# EAGLE design sensorBoardSchematic2 (EAGLE 7.5.0)
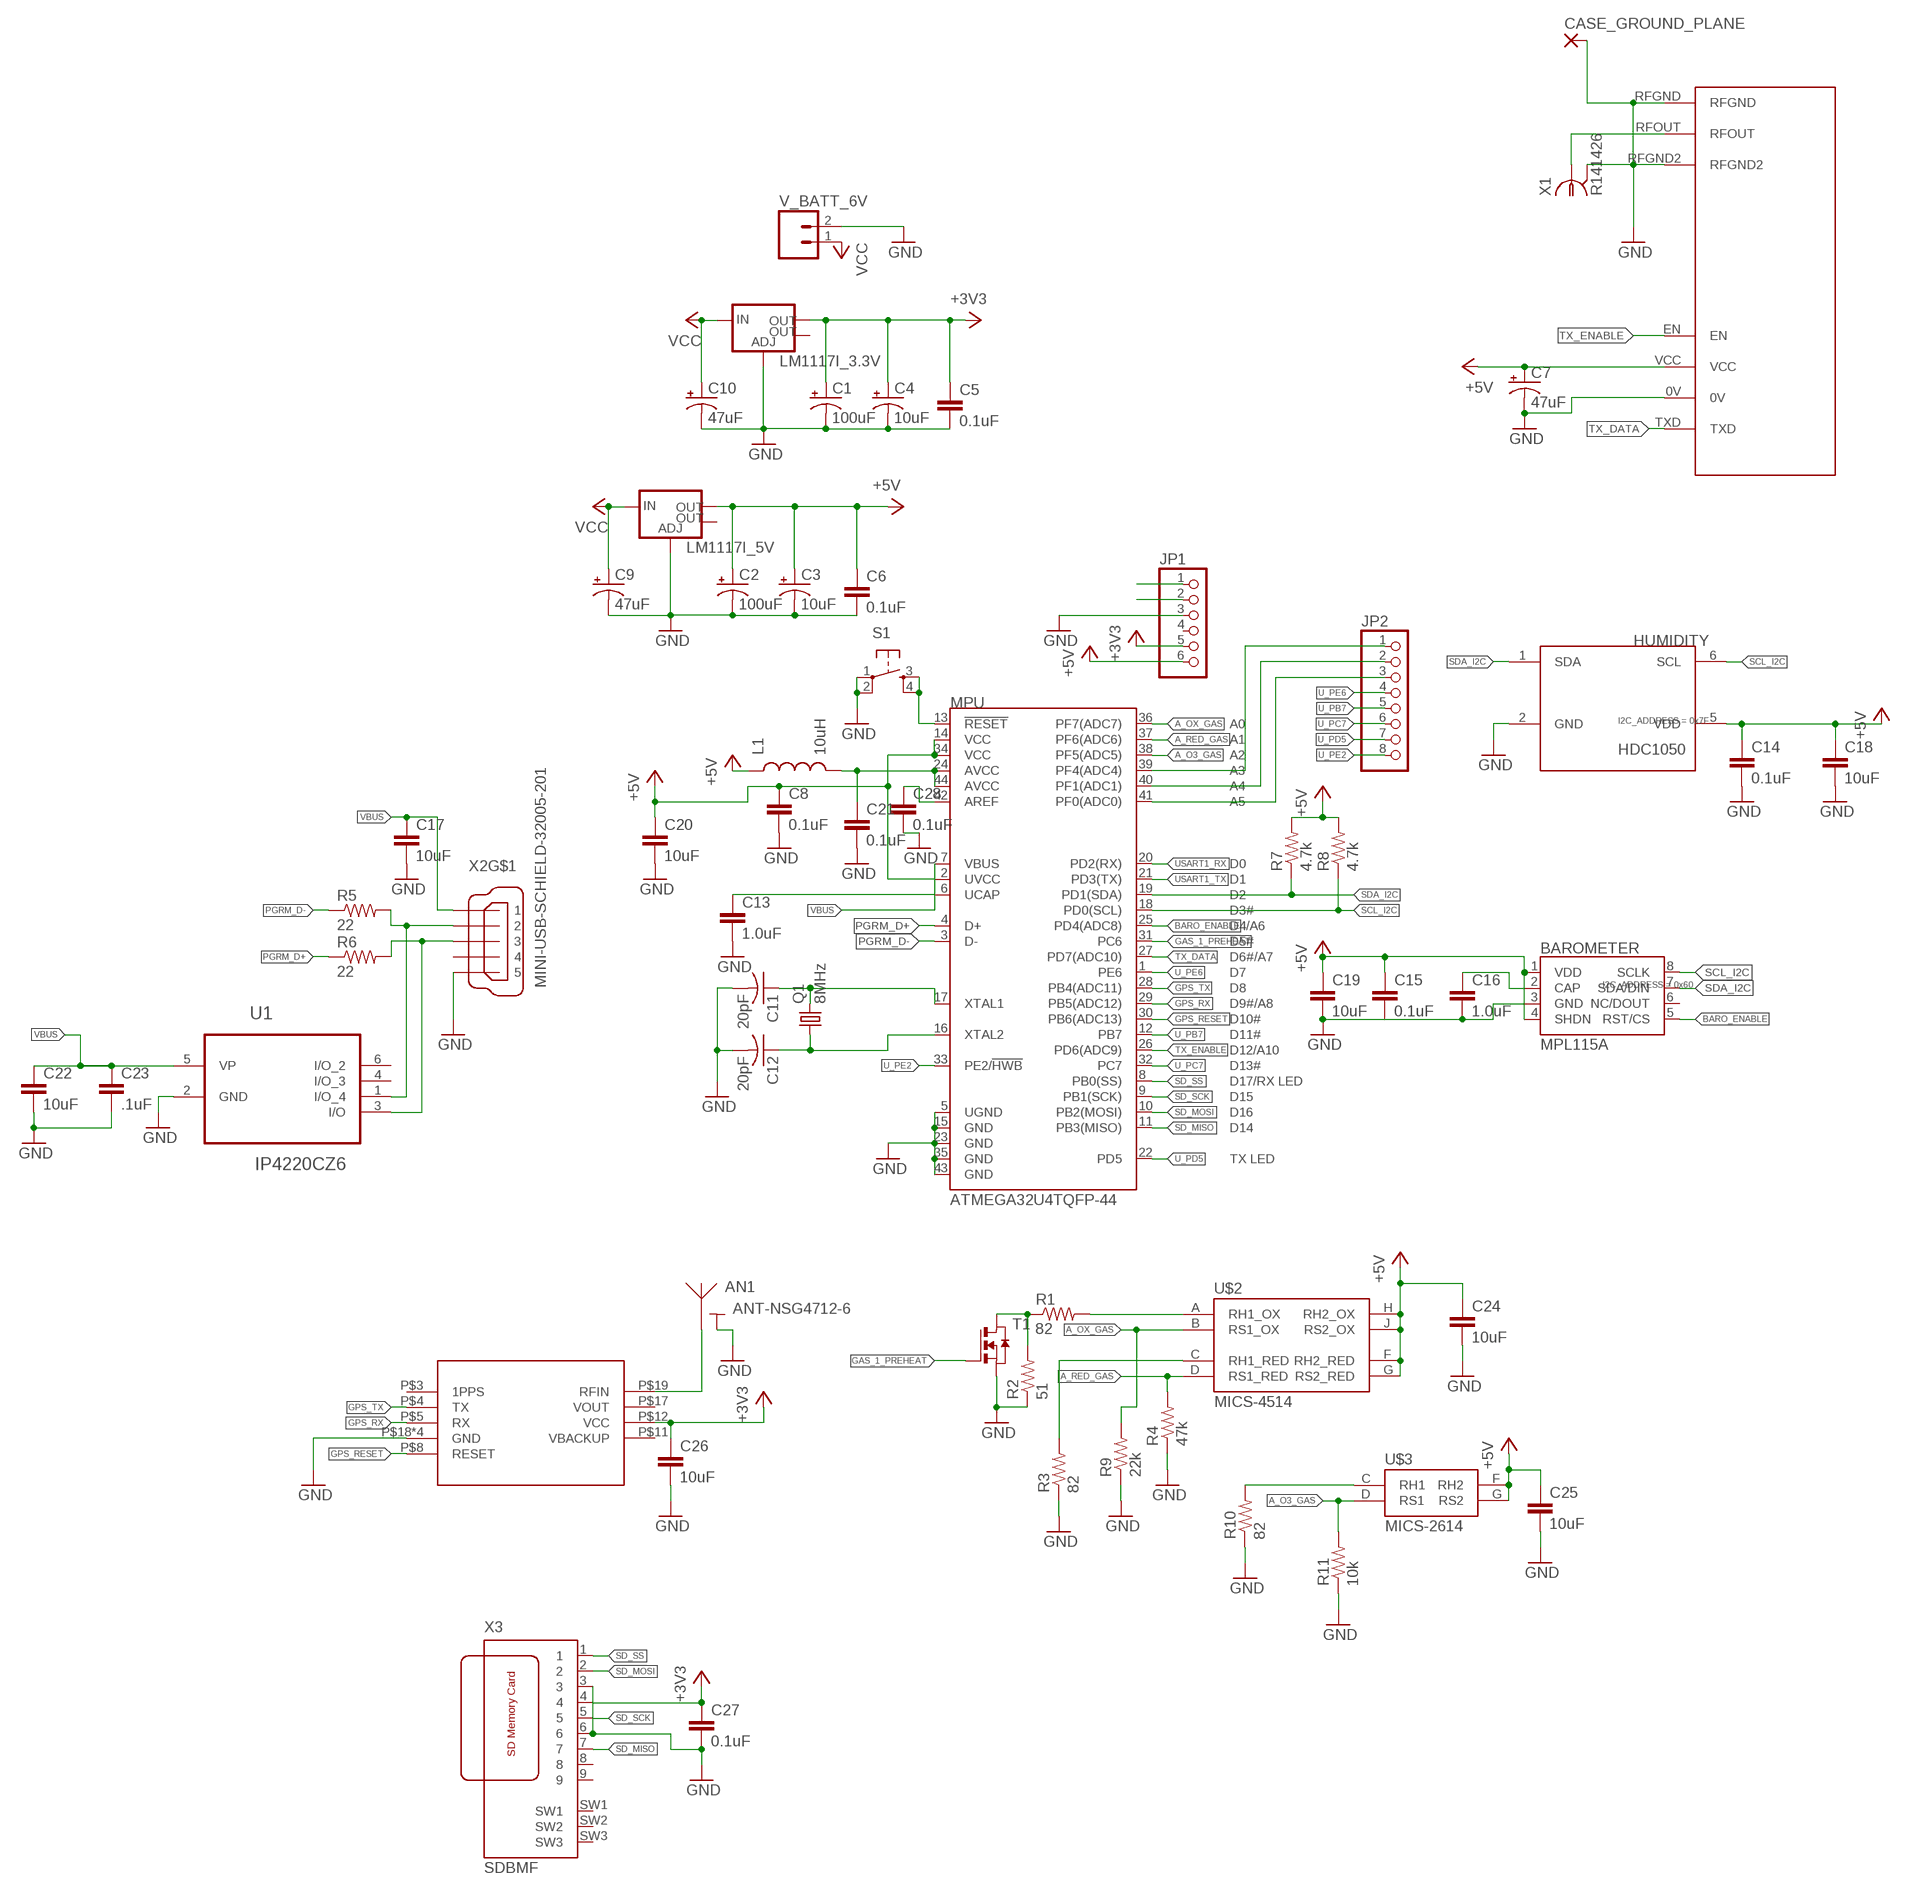
[diagram p0: schematic, sheet 1]

## Parts
AN1  ANT-NSG4712-6  [ANT-NSG4712-6]
BAROMETER  MPL115A  [LGA8]
C1  100uF  100UF-10V-10%(TANT)  [EIA7343]
C2  100uF  100UF-10V-10%(TANT)  [EIA7343]
C3  10uF  10UF-TANT  [EIA3216]
C4  10uF  10UF-TANT  [EIA3216]
C5  0.1uF  .1UF-CERCAP-08604  [0402-CAP]
C6  0.1uF  .1UF-CERCAP-08604  [0402-CAP]
C7  47uF  47UF-10V-10%(TANT)  [EIA3528]
C8  0.1uF  1.0UF-16V-10%(0603)  [0603-CAP]
C9  47uF  47UF-10V-10%(TANT)  [EIA3528]
C10  47uF  47UF-10V-10%(TANT)  [EIA3528]
C11  20pF  C-USC0402  [C0402]
C12  20pF  C-USC0402  [C0402]
C13  1.0uF  1.0UF-16V-10%(0603)  [0603-CAP]
C14  0.1uF  1.0UF-16V-10%(0603)  [0603-CAP]
C15  0.1uF  1.0UF-16V-10%(0603)  [0603-CAP]
C16  1.0uF  1.0UF-16V-10%(0603)  [0603-CAP]
C17  10uF  1.0UF-16V-10%(0603)  [0603-CAP]
C18  10uF  1.0UF-16V-10%(0603)  [0603-CAP]
C19  10uF  1.0UF-16V-10%(0603)  [0603-CAP]
C20  10uF  1.0UF-16V-10%(0603)  [0603-CAP]
C21  0.1uF  1.0UF-16V-10%(0603)  [0603-CAP]
C22  10uF  1.0UF-16V-10%(0603)  [0603-CAP]
C23  .1uF  1.0UF-16V-10%(0603)  [0603-CAP]
C24  10uF  1.0UF-16V-10%(0603)  [0603-CAP]
C25  10uF  1.0UF-16V-10%(0603)  [0603-CAP]
C26  10uF  1.0UF-16V-10%(0603)  [0603-CAP]
C27  0.1uF  .1UF-CERCAP-08604  [0402-CAP]
C28  0.1uF  1.0UF-16V-10%(0603)  [0603-CAP]
CASE_GROUND_PLANE  3,81/1,4  [3,81/1,4]
HUMIDITY  HDC1050  [TI-S-PWSON-N6]
IC1  RXM-GPS-FM  [SMD-22]
JP1  PINHD-1X6  [1X06]
JP2  PINHD-1X8  [1X08]
L1  10uH  INDUCTOR1007  [1007]
LM1117I_3.3V  V_REG_LM1117SOT223  [SOT223]
LM1117I_5V  V_REG_LM1117SOT223  [SOT223]
MPU  ATMEGA32U4TQFP-44  [TQFP44]
Q1  8MHz  CRYSTALHC49U70  [HC49U70]
R1  82  RESISTOR0402-RES  [0402-RES]
R2  51  RESISTOR0402-RES  [0402-RES]
R3  82  RESISTOR0402-RES  [0402-RES]
R4  47k  RESISTOR0402-RES  [0402-RES]
R5  22  RESISTOR0402-RES  [0402-RES]
R6  22  RESISTOR0402-RES  [0402-RES]
R7  4.7k  RESISTOR0402-RES  [0402-RES]
R8  4.7k  RESISTOR0402-RES  [0402-RES]
R9  22k  RESISTOR0402-RES  [0402-RES]
R10  82  RESISTOR0402-RES  [0402-RES]
R11  10k  RESISTOR0402-RES  [0402-RES]
S1  TAC_SWITCHPTH  [TACTILE-PTH]
T1  NMOSSOT23  [SOT-23]
U1  IP4220CZ6  [SOT95P275X110-6N]
U$1  RADIOMETRIX-HX1  [RADIOMETRIX-HX1]
U$2  MICS-4514  [MICS_10-SMD]
U$3  MICS-2614  [MICS_10-SMD]
V_BATT_6V  M025MM  [SCREWTERMINAL-5MM-2]
X1  R141426  [R141426]
X2  MINI-USB-SCHIELD-32005-201  [32005-201]
X3  SDBMF  [SDBMF-009XXBXX2]

## Nets
+3V3: C1.A(+) C4.A(+) C5.1 C26.1 C27.1 IC1.P$12(VCC) JP1.5 LM1117I_3.3V.2(OUT) X3.4
+5V: BAROMETER.1(VDD) BAROMETER.4(SHDN) C2.A(+) C3.A(+) C6.1 C7.A(+) C8.1 C14.1 C15.1 C18.1 C19.1 C20.1 C24.1 C25.1 HUMIDITY.5(VDD) JP1.6 L1.1 LM1117I_5V.2(OUT) MPU.2(UVCC) MPU.14(VCC) MPU.34(VCC) R7.2 R8.2 U$1.VCC U$2.F(RH2_RED) U$2.G(RS2_RED) U$2.H(RH2_OX) U$2.J(RS2_OX) U$3.F(RH2) U$3.G(RS2)
A_O3_GAS: MPU.38(PF5(ADC5)) R11.2 U$3.D(RS1)
A_OX_GAS: MPU.36(PF7(ADC7)) R9.2 U$2.B(RS1_OX)
A_RED_GAS: MPU.37(PF6(ADC6)) R4.2 U$2.D(RS1_RED)
BARO_ENABLE: BAROMETER.5(RST/CS) MPU.25(PD4(ADC8))
GAS_1_PREHEAT: MPU.31(PC6) T1.3(G)
GND: AN1.G@1(G) AN1.G@2(G) AN1.G@3(G) AN1.G@4(G) AN1.G@5(G) AN1.G@6(G) AN1.G@7(G) AN1.G@8(G) AN1.G@9(G) AN1.G@10(G) BAROMETER.3(GND) C1.C(-) C2.C(-) C3.C(-) C4.C(-) C5.2 C6.2 C7.C(-) C8.2 C9.C(-) C10.C(-) C11.2 C12.2 C13.2 C14.2 C15.2 C16.2 C17.2 C18.2 C19.2 C20.2 C21.2 C22.2 C23.2 C24.2 C25.2 C26.2 C27.2 C28.2 CASE_GROUND_PLANE.1(P) HUMIDITY.2(GND) IC1.P$18(GND) IC1.P$20(GND) IC1.P$21(GND) IC1.P$22(GND) JP1.3 LM1117I_3.3V.1(ADJ) LM1117I_5V.1(ADJ) MPU.5(UGND) MPU.15(GND) MPU.23(GND) MPU.35(GND) MPU.43(GND) R2.1 R3.1 R4.1 R9.1 R10.1 R11.1 S1.1 S1.2 T1.2(S) U1.2(GND) U$1.0V U$1.RFGND U$1.RFGND2 V_BATT_6V.2 X1.2 X1.3 X1.4 X1.5 X2.5 X3.3 X3.6
GPS_RESET: IC1.P$8(RESET) MPU.30(PB6(ADC13))
GPS_RX: IC1.P$5(RX) MPU.29(PB5(ADC12))
GPS_TX: IC1.P$4(TX) MPU.28(PB4(ADC11))
N$1: MPU.13(!RESET) S1.3 S1.4
N$2: U$1.RFOUT X1.1
N$3: AN1.A(ANT) IC1.P$19(RFIN)
N$4: C21.1 L1.2 MPU.24(AVCC) MPU.44(AVCC)
N$5: R1.2 U$2.A(RH1_OX)
N$6: C11.1 MPU.17(XTAL1) Q1.2
N$7: BAROMETER.2(CAP) C16.1
N$8: C12.1 MPU.16(XTAL2) Q1.1
N$10: R5.2 U1.1(I/O_4) X2.2
N$11: R6.2 U1.3(I/O) X2.3
N$12: C13.1 MPU.6(UCAP)
N$13: X2.1
N$14: R1.1 R2.2 T1.1(D)
N$15: JP2.1 MPU.39(PF4(ADC4))
N$16: R10.2 U$3.C(RH1)
N$17: JP2.2 MPU.40(PF1(ADC1))
N$18: JP2.3 MPU.41(PF0(ADC0))
N$19: R3.2 U$2.C(RH1_RED)
N$20: C28.1 MPU.42(AREF)
PGRM_D+: MPU.4(D+) R6.1
PGRM_D-: MPU.3(D-) R5.1
SCL_I2C: BAROMETER.8(SCLK) HUMIDITY.6(SCL) MPU.18(PD0(SCL)) R8.1
SD_MISO: MPU.11(PB3(MISO)) X3.7
SD_MOSI: MPU.10(PB2(MOSI)) X3.2
SD_SCK: MPU.9(PB1(SCK)) X3.5
SD_SS: MPU.8(PB0(SS)) X3.1
SDA_I2C: BAROMETER.7(SDA/DIN) HUMIDITY.1(SDA) MPU.19(PD1(SDA)) R7.1
TX_DATA: MPU.27(PD7(ADC10)) U$1.TXD
TX_ENABLE: MPU.26(PD6(ADC9)) U$1.EN
U_PB7: JP2.5 MPU.12(PB7)
U_PC7: JP2.6 MPU.32(PC7)
U_PD5: JP2.7 MPU.22(PD5)
U_PE2: JP2.8 MPU.33(PE2/!HWB)
U_PE6: JP2.4 MPU.1(PE6)
USART1_RX: JP1.1 MPU.20(PD2(RX))
USART1_TX: JP1.2 MPU.21(PD3(TX))
VBUS: C17.1 C22.1 C23.1 MPU.7(VBUS) U1.5(VP)
VCC: C9.A(+) C10.A(+) LM1117I_3.3V.3(IN) LM1117I_5V.3(IN) V_BATT_6V.1
Unconnected: BAROMETER.6(NC/DOUT) IC1.P$3(1PPS) IC1.P$11(VBACKUP) IC1.P$17(VOUT) JP1.4 LM1117I_3.3V.4(OUT) LM1117I_5V.4(OUT) U1.4(I/O_3) U1.6(I/O_2) X2.4 X2.M1(S:S1) X2.M2(S:S2) X2.M3(S:S3) X2.M4(S:S4) X3.8 X3.9 X3.SW1 X3.SW2 X3.SW3

## Library data of the parts
AN1 = roundsolutions:ANT-NSG4712-6: Center frequency: 1575.42 +/-3 MHz 2nd GPS Center Frequency: 1600.25 +/-3 MHz
BAROMETER = SparkFun-Sensors:MPL115A: MPL115A1 (SPI) and MPL115A2 (I2C) Miniature Digital Barometer 5.0x3.0x1.2mm LGA Package; I2C_ADDRESS: 0x60
C1 C2 = SparkFun-Capacitors:100UF-10V-10%(TANT): CAP-07890; PROD_ID: CAP-07890
C3 C4 = SparkFun-Retired:10UF-TANT: 10uF Tantalum SMT CAP-00811- 16V 10% (EIA-3216); PROD_ID: CAP-00811
C5 C6 C27 = SparkFun-Retired:.1UF-CER: .1uF ceramic SMT CAP-00810- 25V +80%/-20% (0603) CAP-08390- 100V 10% (0603) CAP-08604- 25V 5% (0603); PROD_ID: CAP-08604
C7 C9 C10 = SparkFun-Capacitors:47UF-10V-10%(TANT): CAP-08310 47uF Tantalum SMT 10V 10% (EIA-3528); PROD_ID: CAP-08310
C8 C14 C15 C17-C26 C28 = SparkFun-Capacitors:1.0UF-16V-10%(0603): CAP-00868; PROD_ID: CAP-00868; VALUE: 1.0uF
C11 C12 = resistor:C-US: CAPACITOR, American symbol
C13 C16 = SparkFun-Capacitors:1.0UF-16V-10%(0603): CAP-00868; PROD_ID: CAP-00868
CASE_GROUND_PLANE = wirepad:3,81/1,4: THROUGH-HOLE PAD
HUMIDITY = Ava:HDC1050; I2C_ADDRESS: 0x7F
IC1 = linx-addl:RXM-GPS-FM: Linx GPS Module RXM-GPS-FM http://www.mouser.com/ds/2/238/RXM-GPS-FM%20Data%20Guide%20131017-270385.pdf
JP1 = pinhead:PINHD-1X6: PIN HEADER
JP2 = pinhead:PINHD-1X8: PIN HEADER
L1 = SparkFun-Passives:INDUCTOR: Inductors Basic Inductor/Choke - 0603 and 1206. Footprints are not proven and vary greatly between part numbers. INDUCTOR POWER 3.3UH 4.0A SMD 0.197" L x 0.197" W x 0.177" H (5.00mm x 5.00mm x 4.50mm)
LM1117I_3.3V LM1117I_5V = SparkFun-PowerIC:V_REG_LM1117: Voltage Regulator LM1117 Standard adjustable voltage regulator but in SMD form. Spark Fun Electronics SKU : COM-00595; PROD_ID: VREG-08170
MPU = SparkFun-DigitalIC:ATMEGA32U4: Atmel 44-pin 8-bit Microcontroller with 32KBytes of ISP Flash and USB Controller
Q1 = crystal:CRYSTAL: CRYSTAL; OC_FARNELL: unknown; OC_NEWARK: unknown
R1-R11 = SparkFun-Passives:RESISTOR: Resistor Basic schematic elements and footprints for 0603, 1206, and PTH resistors.
S1 = SparkFun-Retired:TAC_SWITCH: Momentary Switch Button commonly used for reset or general input. Spark Fun Electronics SKU : COM-00097 SMT- SWCH-08247
T1 = zetex:NMOSSOT23: MOS FET; OC_FARNELL: unknown; OC_NEWARK: unknown
U1 = NXP_By_element14_Batch_1:IP4220CZ6: Dual Schmitt-Trigger Inverter; MPN: IP4220CZ6; OC_FARNELL: 1506629; OC_NEWARK: 61M6815; PACKAGE: SSOT-6; SUPPLIER: NXP
U$1 = Ava:RADIOMETRIX-HX1
U$2 = SparkFun-Sensors:MICS-4514: Metal oxide MEMS carbon monoxide (CO) and NOx sensor in an SMD package.; PROD_ID: COMP-12310
U$3 = SparkFun-Sensors:MICS-2614: Metal oxide MEMS ozone (O3) sensor in an SMD package.; PROD_ID: COMP-12309
V_BATT_6V = SparkFun-Connectors:M02: Standard 2-pin 0.1" header. Use with - straight break away headers ( PRT-00116) - right angle break away headers (PRT-00553) - swiss pins (PRT-00743) - machine pins (PRT-00117) - female headers (PRT-00115) Molex polarized connector foot print use with: PRT-08233 with associated crimp pins and housings. 2.54_SCREWTERM for use with PRT-10571. 3.5mm Screw Terminal footprints for PRT-08084 5mm Screw Terminal footprints for use with PRT-08432; STOREFRONT_ID: PRT-08432
X1 = con-coax:R141426: BNC COAX CONNECTOR Radiall 50/75 Ohm Spoerle; MF: FARNELL; MPN: R141426161; OC_FARNELL: 4195115; OC_NEWARK: 14J7919
X2 = con-cypressindustries:MINI-USB-SCHIELD-: MINI USB-B Conector Source: www.cypressindustries.com; OC_FARNELL: unknown; OC_NEWARK: unknown
X3 = farnell:SDBMF: SD MEMORY CARD PUSH-PUSH WITH CONNECTOR TYPE B (BIG SWUÌTCH #3) KINGFONT PRECISION INDUSTIAL CO., LTD Source: http://www.farnell.com/datasheets/74273.pdf Best.-Nr.: 9186174 Hersteller: MULTICOMP Herstellerbez.: SDBMF-00915B0T2

## Board
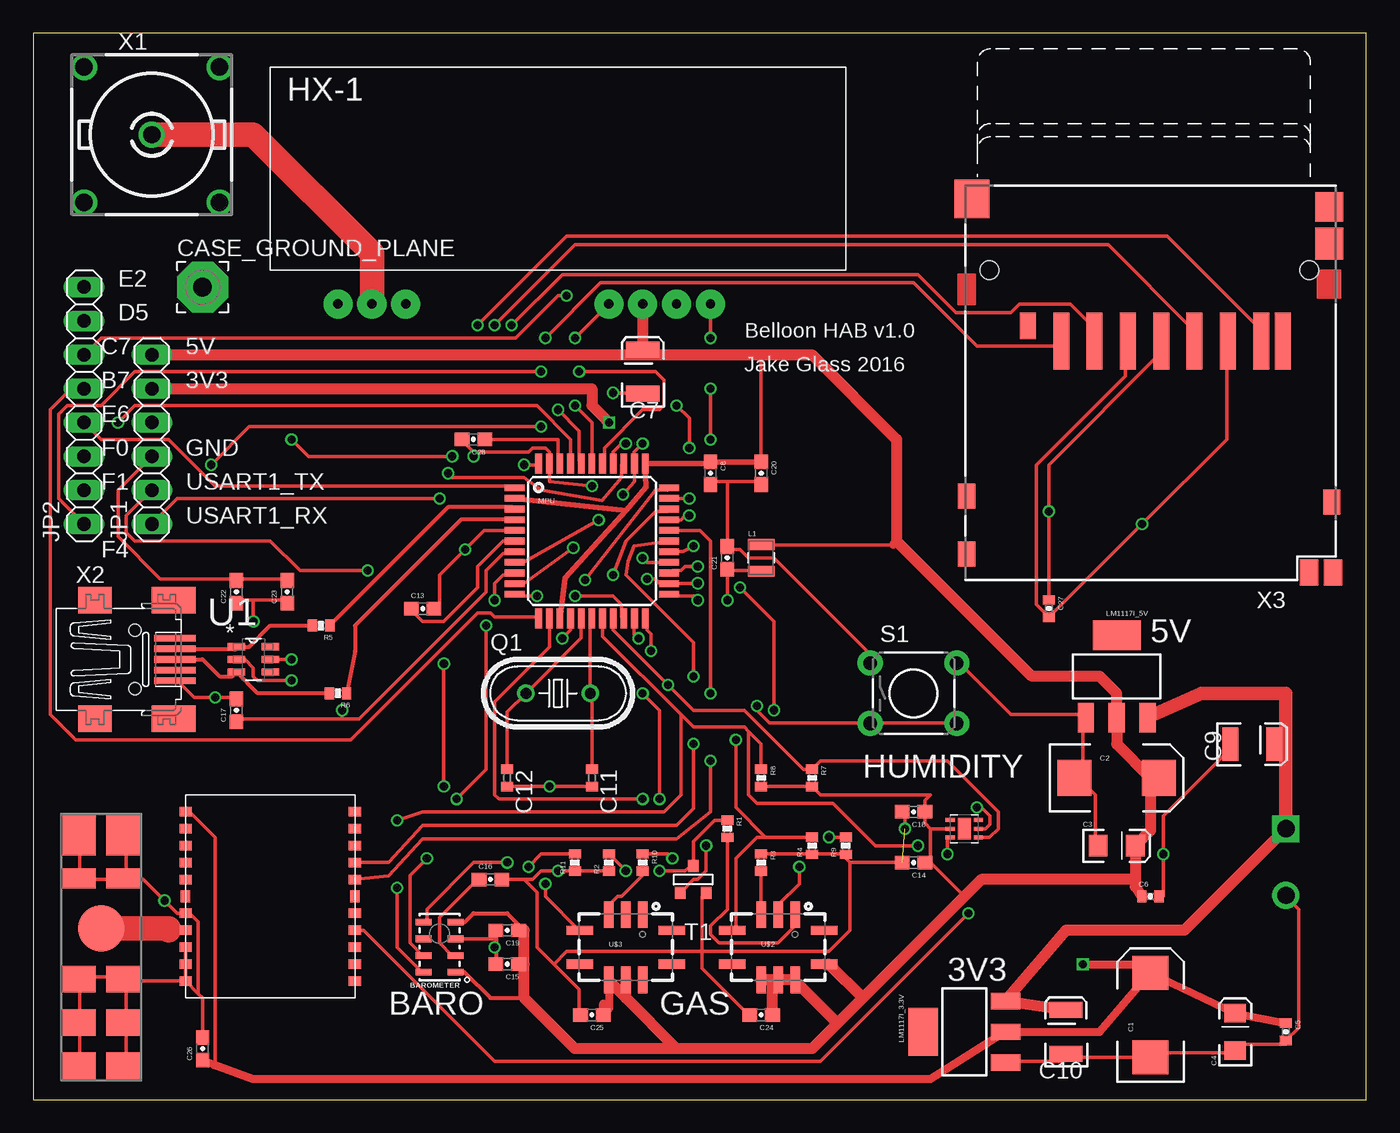
[diagram p1: board, top side]
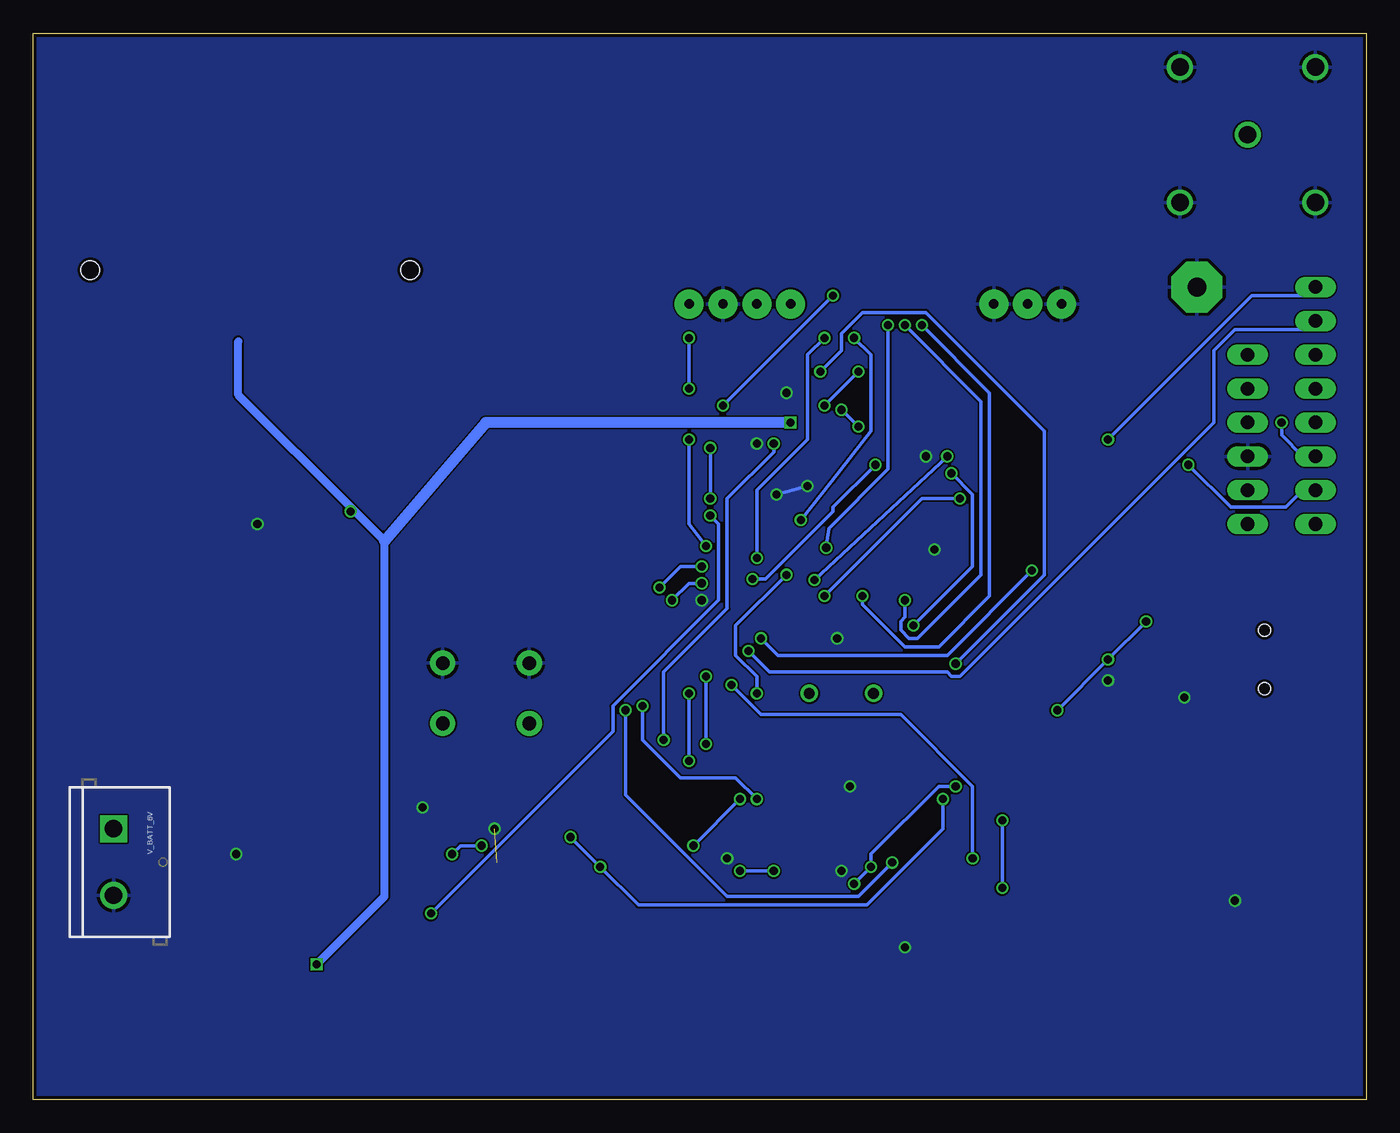
[diagram p2: board, bottom side, seen from below]

Size 100 x 80 mm. Coordinates in mm from the lower left corner, seen from the top.
Outline: 0,0 100,0 100,80 0,80 0,0
Copper layers (1*16): Top 0.035mm / dielectric 1.5mm / Bottom 0.035mm
Design rules "dirt_cheap_dirty_boards.v1": minimum track width 5mil, minimum drill 12mil, track to track 5mil, track to pad 5mil, pad to pad 5mil, via to via 5mil, smd to smd 0mil, copper to edge 10mil, drill to drill 10mil, minimum pad ring 10mil, minimum via ring 6mil, stop-mask expansion 2mil, vias tented up to drill 25mil, thermal gap 10mil

### Footprints (pad centres in the part's own frame; a part is rotated, then mirrored left to right if it is on the bottom)
ANT-NSG4712-6 = smd 3.5 x 3.5: A 0,1.4 | smd 2.5 x 3: G@1 -1.65,8.4; G@2 1.65,8.4 | smd 2.5 x 2: G@3 -1.65,-8.9; G@4 1.65,-8.9; G@5 -1.65,-5.65; G@6 1.65,-5.65; G@7 -1.65,-2.4; G@8 1.65,-2.4 | smd 2.5 x 1.5: G@9 -1.65,5.15; G@10 1.65,5.15
LGA8 = smd 1.2 x 0.5: 1 -1.2,1.875; 2 -1.2,0.625; 3 -1.2,-0.625; 4 -1.2,-1.875; 5 1.2,-1.875; 6 1.2,-0.625; 7 1.2,0.625; 8 1.2,1.875
EIA7343 = smd 2.55 x 2.7: A 3.17,0; C -3.17,0
EIA3216 = smd 1.4 x 1.6: A 1.4,0; C -1.4,0
0402-CAP = smd 0.7 x 0.9: 1 -0.65,0; 2 0.65,0
EIA3528 = smd 1.2 x 2.5: A 1.65,0; C -1.65,0
0603-CAP = smd 1.1 x 1: 1 -0.85,0; 2 0.85,0
C0402 = smd 0.7 x 0.9: 1 -0.65,0; 2 0.65,0
3,81/1,4 = drill 1.397 pad 3.81 octagon: 1 0,0
TI-S-PWSON-N6 = smd 0.3 x 0.7: 1 -0.65,-1.05; 2 0,-1.05; 3 0.65,-1.05; 4 0.65,1.05; 5 0,1.05; 6 -0.65,1.05 | smd 1.6 x 1: 7 0,0
SMD-22 = smd 0.711 x 0.914: P$1 -6.35,0; P$2 -5.08,0; P$3 -3.81,0; P$4 -2.54,0; P$5 -1.27,0; P$7 1.27,0; P$8 2.54,0; P$9 3.81,0; P$10 5.08,0; P$11 6.35,0; P$12 -6.35,-12.7; P$13 -5.08,-12.7; P$14 -3.81,-12.7; P$15 -2.54,-12.7; P$16 -1.27,-12.7; P$18 1.27,-12.7; P$19 2.54,-12.7; P$20 3.81,-12.7; P$21 5.08,-12.7; P$22 6.35,-12.7 | smd 0.914 x 0.711: P$6 0,0; P$17 0,-12.7
1X06 = drill 1.016 long: 1 -6.35,0; 2 -3.81,0; 3 -1.27,0; 4 1.27,0; 5 3.81,0; 6 6.35,0
1X08 = drill 1.016 long: 1 -8.89,0; 2 -6.35,0; 3 -3.81,0; 4 -1.27,0; 5 1.27,0; 6 3.81,0; 7 6.35,0; 8 8.89,0
1007 = smd 2 x 0.8: 1 0,1; 2 0,-1
SOT223 = smd 1.219 x 2.235: 1 -2.311,-3.099; 2 0,-3.099; 3 2.311,-3.099 | smd 3.6 x 2.2: 4 0,3.099
TQFP44 = smd 1.5 x 0.5: 1 -5.8,4; 2 -5.8,3.2; 3 -5.8,2.4; 4 -5.8,1.6; 5 -5.8,0.8; 6 -5.8,0; 7 -5.8,-0.8; 8 -5.8,-1.6; 9 -5.8,-2.4; 10 -5.8,-3.2; 11 -5.8,-4; 23 5.8,-4; 24 5.8,-3.2; 25 5.8,-2.4; 26 5.8,-1.6; 27 5.8,-0.8; 28 5.8,0; 29 5.8,0.8; 30 5.8,1.6; 31 5.8,2.4; 32 5.8,3.2; 33 5.8,4 | smd 0.5 x 1.5: 12 -4,-5.8; 13 -3.2,-5.8; 14 -2.4,-5.8; 15 -1.6,-5.8; 16 -0.8,-5.8; 17 0,-5.8; 18 0.8,-5.8; 19 1.6,-5.8; 20 2.4,-5.8; 21 3.2,-5.8; 22 4,-5.8; 34 4,5.8; 35 3.2,5.8; 36 2.4,5.8; 37 1.6,5.8; 38 0.8,5.8; 39 0,5.8; 40 -0.8,5.8; 41 -1.6,5.8; 42 -2.4,5.8; 43 -3.2,5.8; 44 -4,5.8
HC49U70 = drill 0.813: 1 -2.413,0; 2 2.413,0
0402-RES = smd 0.7 x 0.9: 1 -0.65,0; 2 0.65,0
TACTILE-PTH = drill 1.016 pad 1.88: 1 -3.251,2.261; 2 3.251,2.261; 3 -3.251,-2.261; 4 3.251,-2.261
SOT-23 = smd 0.787 x 0.889: 1 0.025,-1.016; 2 -0.94,1.016; 3 0.991,1.016
SOT95P275X110-6N = smd 1.321 x 0.559: 1 -1.27,0.94; 2 -1.27,0; 3 -1.27,-0.94; 4 1.27,-0.94; 5 1.27,0; 6 1.27,0.94
RADIOMETRIX-HX1 = drill 0.7 pad 2.184: 0V 8.89,-10.16; EN 3.81,-10.16; RFGND -11.43,-10.16; RFGND2 -16.51,-10.16; RFOUT -13.97,-10.16; TXD 11.43,-10.16; VCC 6.35,-10.16
MICS_10-SMD = smd 0.7 x 2: A 1.27,2.45; B 0,2.45; C -1.27,2.45; F -1.27,-2.45; G 0,-2.45; H 1.27,-2.45 | smd 2 x 0.7: D -3.45,1.27; E -3.45,-1.27; J 3.45,-1.27; K 3.45,1.27
SCREWTERMINAL-5MM-2 = drill 1.3 pad 2.032 square: 1 0,0 | drill 1.3 pad 2.032: 2 5,0
R141426 = drill 1.295: 1 0,0; 2 5.08,5.08; 3 -5.08,5.08; 4 -5.08,-5.08; 5 5.08,-5.08
32005-201 = smd 3.1 x 0.5: 1 3,1.6; 2 3,0.8; 3 3,0; 4 3,-0.8; 5 3,-1.6 | smd 2.5 x 2: M1 -3,-4.45; M2 -3,4.45 | smd 3.3 x 2: M3 2.9,4.45; M4 2.9,-4.45 | hole 0.9: 0,2.2; 0,-2.2
SDBMF-009XXBXX2 = smd 1.2 x 4.3: 1 6.7,5.325; 2 4.2,5.325; 3 1.7,5.325; 4 -0.8,5.325; 5 -3.3,5.325; 6 -5.8,5.325; 7 -8.3,5.325; 8 -9.925,5.325 | smd 1.2 x 2: 9 9.2,4.175 | smd 2.1 x 2.4: M1 -13.4,-2 | smd 2.6 x 2.9: M2 13.4,-5.35 | smd 1.3 x 1.9: M3 -13.6,17.4; M4 13.8,16.95; M5 13.8,21.3 | smd 1.4 x 1.95: SW1 -11.9,22.7; SW3 -13.7,22.7 | smd 2.1 x 2.2: SW2 -13.4,-4.75 | hole 1.4: -11.9,0; 12.1,0

### Placement (x,y rotation side)
AN1  5.08,11.43 0 top
BAROMETER  30.48,11.43 180 top
C1  83.82,6.35 90 top
C2  81.28,24.13 0 top
C3  81.28,19.05 0 top
C4  90.17,5.08 90 top
C5  93.98,5.08 270 top
C6  83.82,15.24 0 top
C7  45.72,54.61 90 top
C8  50.8,46.99 270 top
C9  91.44,26.67 0 top
C10  77.47,5.08 90 top
C11  41.91,24.13 270 top
C12  35.56,24.13 270 top
C13  29.21,36.83 0 top
C14  66.04,17.78 180 top
C15  35.56,10.16 180 top
C16  34.29,16.51 0 top
C17  15.24,29.21 90 top
C18  66.04,21.59 180 top
C19  35.56,12.7 180 top
C20  54.61,46.99 270 top
C21  52.07,40.64 90 top
C22  15.24,38.1 90 top
C23  19.05,38.1 90 top
C24  54.61,6.35 180 top
C25  41.91,6.35 180 top
C26  12.7,3.81 90 top
C27  76.2,36.83 270 top
C28  33.02,49.53 180 top
CASE_GROUND_PLANE  12.7,60.96 0 top
HUMIDITY  69.85,20.32 90 top
IC1  24.13,15.24 270 top
JP1  8.89,49.53 90 top
JP2  3.81,52.07 90 top
L1  54.61,40.64 0 top
LM1117I_3.3V  69.85,5.08 90 top
LM1117I_5V  81.28,31.75 0 top
MPU  41.91,41.91 0 top
Q1  39.37,30.48 0 top
R1  52.07,20.32 270 top
R2  43.18,17.78 90 top
R3  54.61,17.78 270 top
R4  58.42,19.05 90 top
R5  21.59,35.56 180 top
R6  22.86,30.48 180 top
R7  58.42,24.13 270 top
R8  54.61,24.13 270 top
R9  60.96,19.05 90 top
R10  45.72,17.78 270 top
R11  40.64,17.78 90 top
S1  66.04,30.48 0 top
T1  49.53,16.51 180 top
U1  [SOT95P275X110-6N]  16.51,33.02 0 top
U$1  39.37,69.85 0 top
U$2  55.88,11.43 0 top
U$3  44.45,11.43 0 top
V_BATT_6V  93.98,20.32 270 bottom
X1  APRS_ANT  [R141426]  8.89,72.39 0 top
X2  USB_PGRM  [32005-201]  7.62,33.02 0 top
X3  83.82,62.23 180 top

### Tracks (layer width: path | path; a pad name or v marks a point on that pad's centre or on a via)
+3V3  (via drill 0.6, 0.61)
  Top 0.254: C27.1 v76.2,44.13 76.2,47.62 84.45,55.88 84.45,56.83 X3.4 | IC1.P$12 11.75,21.59 13.65,19.68 13.65,2.86 13.53,2.59 | 83.82,10.16 C1.A
  Top 0.61: C26.1 13.53,2.59 16.51,1.52 67.31,1.52 LM1117I_3.3V.2 80.01,5.08 C1.A C4.A C5.1 | v78.74,10.16 83.82,10.16
  Top 0.813: v43.18,50.8 41.91,52.07 41.91,53.34 JP1.5
  Bottom 0.254: v76.2,44.13 76.04,44.29
  Bottom 0.61: v78.74,10.16 73.66,15.24 73.66,41.91 76.04,44.29 84.62,52.87 X3.4
  Bottom 0.813: v43.18,50.8 66.04,50.8 73.66,41.91
+5V
  Top 0.254: 67.31,20.32 66.89,20.74 C18.1 66.89,22.44 67.31,22.86 59.04,22.86 R7.2 R8.2 | HUMIDITY.5 67.31,20.32 | 67.31,20.32 67.31,18.2 C14.1 67.31,17.78 69.85,15.24 | C19.1 36.83,12.7 | C2.A 83.82,24.13 | L1.1 54.61,41.59 64.45,41.59 64.5,41.64 | 54.61,55.88 C20.1
  Top 0.305: BAROMETER.4 32.35,13.3 33.02,13.97 35.56,13.97 36.83,12.7 | BAROMETER.1 32.35,9.55 34.29,7.62 36.83,7.62 | C15.1 36.83,10.16
  Top 0.406: MPU.14 39.88,39.12 44.45,44.2 | 44.45,44.2 45.97,45.97 MPU.34 50.67,47.71 C8.1 C20.1 | MPU.2 44.45,44.2
  Top 0.61: 64.5,41.64 64.77,41.91 | 54.7,8.89 U$2.F | 43.27,8.89 U$3.F 43.18,8.89 43.18,6.77 C25.1 42.76,7.2
  Top 0.813: U$1.VCC C7.A 45.72,55.88 | 45.72,55.88 54.61,55.88 58.42,55.88 64.77,49.53 64.77,41.91 74.93,31.75 80.01,31.75 81.28,30.48 LM1117I_5V.2 81.28,26.67 83.82,24.13 83.82,20.19 C3.A 82.68,16.51 | JP1.6 45.72,55.88 | 82.68,16.51 82.68,15.99 C6.1 | 82.68,16.51 71.12,16.51 69.85,15.24 62.23,7.62 | 62.23,7.62 60.33,5.71 | 60.33,5.71 58.42,3.81 48.26,3.81 | 48.26,3.81 44.45,7.62 | 43.18,8.89 44.45,7.62 | 44.45,7.62 U$3.G | U$2.J 59.69,10.16 62.23,7.62 | 60.33,5.71 57.15,8.89 U$2.H U$2.G | U$2.G 54.7,8.98 54.61,8.89 U$2.F | C24.1 55.46,8.56 U$2.G | 48.26,3.81 40.64,3.81 36.83,7.62 36.83,10.16 36.83,12.7
A_O3_GAS  (via drill 0.61)
  Top 0.254: v37.15,17.46 38.1,18.41 40.64,18.41 R11.2 | v38.42,16.19 38.42,15.24 40.96,12.7 U$3.D | v40.96,54.61 46.67,54.61 47.31,53.98 47.31,52.07 46.99,51.75 45.72,51.75 42.86,48.9 42.86,47.94 MPU.38 | v30.8,23.5 v30.8,32.7
  Bottom 0.254: v38.42,16.19 v37.15,17.46 37.15,18.41 32.07,23.5 v30.8,23.5 | v40.96,54.61 39.37,56.2 39.37,57.47 37.78,59.05 33.02,59.05 24.13,50.16 24.13,39.37 v30.8,32.7
A_OX_GAS  (via drill 0.61)
  Top 0.254: v59.69,19.68 60.96,19.68 R9.2 | v57.47,17.46 57.47,16.19 55.88,14.61 U$2.B | v31.11,46.99 31.43,46.67 36.83,46.67 38.1,45.72 42.67,44.96 44.13,46.67 44.13,47.62 MPU.36 | v33.97,35.56 33.97,24.77 v31.75,22.54
  Bottom 0.254: v59.69,19.68 v57.47,17.46 54.61,14.61 37.47,14.61 31.75,20.32 v31.75,22.54 | v31.11,46.99 29.53,45.4 29.53,40.01 v33.97,35.56
A_RED_GAS  (via drill 0.61)
  Top 0.254: 54.93,19.68 54.29,19.68 52.7,18.1 52.7,12.7 U$2.D | 54.93,19.68 58.42,19.68 R4.2 | v44.45,49.21 44.13,49.21 43.5,48.58 43.5,47.94 MPU.37 | v52.7,26.99 52.7,21.91 54.93,19.68
  Bottom 0.254: v44.45,49.21 44.45,48.58 47.94,45.09 47.94,36.83 52.7,32.07 v52.7,26.99
BARO_ENABLE  (via drill 0.61)
  Top 0.254: v35.56,17.78 33.02,17.78 29.53,14.29 29.53,13.34 BAROMETER.5 | v55.56,29.21 55.56,35.88 v53.02,38.42 | v49.85,40.01 48.9,40.01 48.58,39.69 47.94,39.69 MPU.25
  Bottom 0.254: v35.56,17.78 38.1,15.24 47.94,15.24 55.56,22.86 v55.56,29.21 | v53.02,38.42 51.44,40.01 v49.85,40.01
GAS_1_PREHEAT  (via drill 0.61)
  Top 0.254: v50.48,19.05 50.48,17.14 49.85,16.51 49.53,16.51 48.58,15.56 T1.3 | v46.99,22.54 46.99,29.21 v45.72,30.48 | MPU.31 47.62,44.13 46.67,44.13 44.45,41.91 v43.5,39.37
  Bottom 0.254: v46.99,22.54 v50.48,19.05 | v45.72,30.48 45.72,31.75 47.31,33.34 47.31,35.56 v43.5,39.37
GND  (via drill 0.6, 0.61)  (1 unrouted)
  Top 0.254: MPU.5 33.82,42.71 v32.38,41.27 30.48,39.37 30.48,36.83 C13.2 | 40.64,17.14 43.18,17.14 R2.1 | 36.83,16.51 37.47,16.51 38.1,17.14 v39.37,17.14 40.64,17.14 | 36.83,16.51 C16.2 | 40.64,17.14 R11.1 | 39.05,10.16 37.78,11.43 37.78,15.56 36.83,16.51 | 39.05,10.16 40.96,8.26 40.96,6.35 C25.2 | 58.42,18.41 60.96,18.41 R9.1 60.96,18.1 61.28,17.78 | 58.42,18.41 54.61,18.41 R3.1 | 58.42,18.41 R4.1 | 61.28,17.78 C14.2 | 50.16,11.11 50.16,9.84 53.66,6.35 C24.2 | 50.16,11.11 50.16,15.24 T1.2 | 61.28,17.78 61.28,12.7 59.69,11.11 50.16,11.11 | 39.05,10.16 40.01,11.11 50.16,11.11 | 76.2,36.2 v83.19,43.18 89.53,49.53 89.53,56.83 X3.6 | 76.2,36.2 75.25,37.15 75.25,47.62 81.92,54.29 81.92,56.83 X3.3 | 76.2,36.2 C27.2 | AN1.G@1 3.49,19.68 3.49,16.83 AN1.G@9 3.49,16.51 6.67,16.51 AN1.G@10 | AN1.G@10 6.99,16.51 8.26,16.51 v9.84,14.92 10.79,13.97 IC1.P$18 11.75,13.97 12.38,13.34 12.38,7.94 | AN1.G@2 6.99,19.68 6.99,16.83 AN1.G@10 | AN1.G@3 3.49,2.54 3.49,5.71 AN1.G@5 3.49,6.03 3.49,8.89 AN1.G@7 3.49,9.21 6.67,9.21 AN1.G@8 6.99,8.89 | IC1.P$22 IC1.P$21 IC1.P$20 | C26.2 12.7,7.62 12.38,7.94 | IC1.P$22 12.38,7.94 | AN1.G@4 6.99,2.54 6.99,5.71 AN1.G@6 6.99,6.03 6.99,8.89 | 6.99,8.89 IC1.P$22 | 77.47,3.17 77.15,2.86 73.03,2.86 LM1117I_3.3V.1 | 77.47,3.17 C1.C 83.82,3.49 90.17,3.49 C4.C 90.17,3.81 90.49,4.13 93.98,4.13 C5.2 93.98,4.45 94.93,5.4 94.93,14.29 93.98,15.24 V_BATT_6V.2 | 77.47,3.17 C10.C | C6.2 84.77,15.24 v84.77,18.41 84.77,21.27 89.53,26.04 89.53,26.67 C9.C | 78.74,23.81 78.42,24.13 C2.C 78.74,23.81 | 78.74,23.81 79.69,22.86 79.69,19.05 C3.C | 78.74,23.81 78.74,28.57 LM1117I_5V.1 78.74,28.89 73.34,28.89 69.53,32.7 S1.2
  Top 0.254: C17.2 15.24,30.16 v13.65,30.16 12.06,30.16 10.79,31.43 X2.5 | 33.02,48.58 32.38,49.21 32.38,49.53 C28.2 | 33.02,48.58 37.15,48.58 37.47,48.9 38.42,48.9 38.73,48.58 | 38.73,47.94 MPU.43 38.73,48.58 | 52.07,46.35 54.61,46.35 C20.2 | 52.07,46.35 50.8,46.35 C8.2 | 52.07,46.35 C21.2 52.07,41.27 53.02,41.27 53.66,40.64 55.56,40.64 62.55,33.66 62.55,33.02 S1.1 | C12.2 35.56,23.5 v38.73,23.5 41.91,23.5 C11.2 | 15.24,39.05 19.05,39.05 C23.2 | 34.71,12.06 31.75,12.06 BAROMETER.3 | HUMIDITY.2 71.44,20.32 71.75,20.64 71.75,21.27 71.12,21.91 v70.8,21.91 | v47.94,18.1 47.62,18.41 45.72,18.41 R10.1 | v65.41,20.32 65.41,21.59 C18.2 | U1.2 15.88,33.02 16.51,32.38 16.51,31.75 16.83,31.43 v19.37,31.43 | v39.69,34.61 40.32,35.24 40.32,35.88 MPU.15 | v49.85,37.47 49.53,37.78 47.94,37.78 MPU.23 | v45.72,49.21 45.09,48.58 45.09,47.94 MPU.35 45.11,46.38 v44.25,45.39 | v34.61,11.43 34.71,11.43 | 15.24,39.05 9.53,39.05 6.35,42.23 6.35,45.72 JP1.3 | 15.24,39.05 C22.2 | v43.5,53.02 45.72,53.02 C7.C | v33.02,48.26 33.02,48.58 | 38.73,48.58 38.73,46.35 v41.91,46.02
  Top 0.305: C19.2 34.71,12.06 34.71,11.43 C15.2
  Bottom 0.254: v41.91,46.02 v44.25,45.39
  pour Bottom: 0,80.01 100.33,80.01 100.33,1.27 100.33,0 0,0
GPS_RESET  (via drill 0.61)
  Top 0.254: IC1.P$8 24.77,12.7 34.61,2.86 59.05,2.86 v70.17,13.97 | v49.21,43.81 48.9,43.81 48.58,43.5 47.94,43.5 MPU.30
  Bottom 0.254: v70.17,13.97 56.52,27.62 56.52,29.53 48.58,37.47 48.58,43.18 v49.21,43.81
GPS_RX  (via drill 0.6)
  Top 0.254: IC1.P$5 26.67,16.76 29.21,19.56 48.26,19.56 50.8,21.59 v50.8,25.4 | v50.8,30.48 50.8,41.91 50,42.71 MPU.29
  Bottom 0.254: v50.8,25.4 v50.8,30.48
GPS_TX  (via drill 0.6)
  Top 0.254: IC1.P$4 26.67,17.78 29.21,20.57 48.26,20.57 49.53,21.84 v49.53,26.67 | v49.53,31.75 49.53,34.29 44.45,39.37 44.63,40.39 45.09,41.53 MPU.28
  Bottom 0.254: v49.53,26.67 v49.53,31.75
N$1  (via drill 0.61)
  Top 0.254: v45.72,22.54 34.92,22.54 34.61,22.86 34.61,29.84 38.73,33.97 38.73,35.88 MPU.13 | v54.29,29.53 54.29,29.21 55.24,28.26 62.55,28.26 S1.3 62.87,28.26 69.22,28.26 S1.4
  Bottom 0.254: v45.72,22.54 47.31,24.13 51.44,24.13 54.29,26.99 v54.29,29.53
N$2
  Top 1.849: X1.1 16.51,72.39 25.4,63.5 U$1.RFOUT
N$3
  Top 0.254: IC1.P$19 10.79,12.7 10.16,12.83
  Top 1.849: AN1.A 10.16,12.83 10.16,12.7
N$4  (via drill 0.61)
  Top 0.254: 52.07,39.69 54.61,39.69 L1.2 | v49.85,38.73 47.94,38.73 MPU.24 47.62,38.73 46.99,38.73 46.67,39.05 v46.04,39.05 | 52.07,39.69 v52.07,37.47 | 52.07,39.69 C21.1 | v36.83,47.62 37.78,47.62 MPU.44
  Bottom 0.254: v49.85,38.73 50.8,38.73 v52.07,37.47 | v36.83,47.62 40.01,44.45 40.01,44.13 45.09,39.05 v46.04,39.05
N$5
  Top 0.254: R1.2 52.07,14.29 50.8,13.02 50.8,12.38 51.44,11.75 55.88,11.75 57.15,13.02 U$2.A
N$6
  Top 0.254: MPU.17 41.78,35.98 Q1.2 41.91,30.35 C11.1
N$7
  Top 0.254: C16.1 33.34,16.51 30.48,13.65 30.48,11.75 31.43,10.79 BAROMETER.2
N$8
  Top 0.254: MPU.16 41.11,34.63 Q1.1 35.56,29.08 C12.1
N$10
  Top 0.305: X2.2 15.1,33.82 | U1.1 16.18,33.96 17.78,35.56 R5.2
  Top 0.406: 15.1,33.82 U1.1
N$11
  Top 0.305: X2.3 12.7,33.02 13.97,31.75 14.91,31.75 U1.3 16.84,30.48 R6.2
N$12
  Top 0.254: MPU.6 35.24,41.91 33.34,40.01 33.34,38.42 30.8,35.88 29.21,35.88 28.57,36.51 28.57,36.83 C13.1
N$14  (via drill 0.61)
  Top 0.254: R1.1 52.07,20.95 51.12,20.95 49.53,19.37 49.53,17.78 T1.1 49.21,17.46 48.9,17.14 v46.99,17.14 | v44.45,17.14 43.18,18.41 R2.2
  Bottom 0.254: v46.99,17.14 v44.45,17.14
N$15  (via drill 0.61)
  Top 0.254: MPU.39 41.91,50.8 v40.64,52.07 | v38.1,54.61 7.62,54.61 5.08,52.07 2.54,52.07 1.91,51.44 1.91,45.09 JP2.1
  Bottom 0.254: v38.1,54.61 v40.64,52.07
N$16
  Top 0.254: U$3.C 43.18,14.61 43.81,15.24 44.13,15.24 45.72,16.83 R10.2
N$17  (via drill 0.61)
  Top 0.254: v39.37,51.75 40.96,50.16 40.96,47.94 MPU.40 | v38.1,50.48 16.19,50.48 v13.34,47.62
  Bottom 0.254: v38.1,50.48 v39.37,51.75 | v13.34,47.62 10.16,44.45 6.03,44.45 4.76,45.72 JP2.2
N$18  (via drill 0.61)
  Top 0.254: v6.35,50.8 7.62,52.07 37.78,52.07 40.32,49.53 40.32,47.94 MPU.41
  Bottom 0.254: v6.35,50.8 6.35,49.85 4.76,48.26 JP2.3
N$19
  Top 0.254: R3.2 U$2.C
N$20
  Top 0.254: C28.1 39.37,49.53 39.37,47.94 MPU.42
PGRM_D+
  Top 0.305: MPU.4 32.08,43.51 24.13,35.56 24.13,33.64 R6.1
PGRM_D-
  Top 0.305: MPU.3 35.97,44.45 31.13,44.45 R5.1
SCL_I2C  (via drill 0.61)
  Top 0.254: R8.1 54.61,26.67 53.66,27.62 | 53.66,27.62 53.34,27.94 49.53,27.94 48.58,28.89 | 48.58,28.89 42.71,34.76 MPU.18 | v68.58,18.41 68.58,19.68 HUMIDITY.6 | v66.36,19.05 63.18,19.05 60.01,22.23 54.29,22.23 53.66,22.86 53.66,27.62 | v27.3,15.88 27.3,11.43 29.21,9.53 BAROMETER.8 | v27.3,20.95 29.21,21.59 47.31,21.59 48.58,22.86 48.58,28.89
  Bottom 0.254: v68.58,18.41 67.94,19.05 v66.36,19.05 | v27.3,20.95 v27.3,15.88
SD_MISO  (via drill 0.61)
  Top 0.254: v37.78,37.78 36.2,37.78 MPU.11 | v33.34,58.1 40.01,64.77 85.09,64.77 92.08,57.78 92.08,57.15 X3.7
  Bottom 0.254: v37.78,37.78 37.78,37.15 34.61,33.97 32.07,33.97 28.26,37.78 28.26,53.02 v33.34,58.1
SD_MOSI  (via drill 0.61)
  Top 0.254: v40.51,41.4 36.83,38.73 36.2,38.73 MPU.10 | v35.88,58.1 39.69,61.91 66.36,61.91 69.22,59.05 73.34,59.05 73.98,59.69 77.79,59.69 79.38,58.1 79.38,57.15 X3.2
  Bottom 0.254: v40.51,41.4 40.32,42.86 35.88,47.31 v35.88,58.1
SD_SCK  (via drill 0.61)
  Top 0.254: v34.61,37.47 34.61,38.73 35.24,39.37 35.88,39.37 MPU.9 | v34.61,58.1 40.64,64.14 80.64,64.14 87,57.78 87,57.15 X3.5
  Bottom 0.254: v34.61,37.47 34.61,36.2 34.92,35.88 34.92,35.24 34.29,34.61 33.66,34.61 28.89,39.37 28.89,52.39 v34.61,58.1
SD_SS  (via drill 0.61)
  Top 0.254: v42.42,43.48 36.83,40.32 36.2,40.32 MPU.8 | v38.42,57.15 42.55,61.28 66.04,61.28 70.8,56.52 76.52,56.52 76.83,56.83 X3.1
  Bottom 0.254: v42.42,43.48 40.13,46.35 37.15,50.16 37.15,55.88 v38.42,57.15
SDA_I2C  (via drill 0.61)
  Top 0.254: HUMIDITY.1 71.74,19.67 72.39,20.32 72.39,21.59 68.58,25.4 59.04,25.4 R7.1 57.77,24.78 53.34,29.21 49.53,29.21 v47.62,31.11 43.51,35.23 MPU.19 | v29.53,18.1 28.26,16.83 28.26,11.75 29.21,10.79 BAROMETER.7
  Bottom 0.254: v29.53,18.1 29.53,23.5 34.92,28.89 45.4,28.89 v47.62,31.11
TX_DATA  (via drill 0.6)
  Top 0.254: U$1.TXD v50.8,57.15 | v50.8,53.34 v50.8,49.53 | v49.53,41.53 48.73,41.11 MPU.27
  Bottom 0.254: v50.8,57.15 v50.8,53.34 | v50.8,49.53 50.8,43.18 v49.53,41.53
TX_ENABLE  (via drill 0.6)
  Top 0.254: U$1.EN v40.64,57.15 | v45.72,40.64 46.05,40.31 MPU.26
  Bottom 0.254: v40.64,57.15 41.91,55.88 41.91,49.53 45.72,45.72 v45.72,40.64
U_PB7
  Top 0.254: JP2.5 2.86,53.34 1.27,51.75 1.27,28.89 3.17,26.99 23.81,26.99 33.34,36.51 34.29,36.51 34.61,36.2 37.78,36.2 MPU.12
U_PC7  (via drill 0.61)
  Top 0.254: v49.21,45.09 47.94,45.09 MPU.32 | v49.21,48.9 49.21,51.12 v48.26,52.07 | v40.01,60.33 39.37,60.33 36.2,57.15 5.08,57.15 JP2.6
  Bottom 0.254: v49.21,48.9 v49.21,45.09 | v40.01,60.33 v48.26,52.07
U_PD5  (via drill 0.61)
  Top 0.254: v46.35,33.66 46.35,34.92 46.04,35.24 46.04,35.88 MPU.22
  Bottom 0.254: v46.35,33.66 44.77,32.07 31.43,32.07 31.11,31.75 30.48,31.75 11.43,50.8 11.43,56.2 9.84,57.78 4.45,57.78 JP2.7
U_PE2  (via drill 0.61)
  Top 0.254: v31.43,48.26 20.64,48.26 v19.37,49.53 | MPU.33 47.62,45.72 46.67,45.72 v41.4,38.99
  Bottom 0.254: v31.43,48.26 v41.4,38.99 | v19.37,49.53 8.57,60.33 4.45,60.33 JP2.8
U_PE6
  Top 0.254: JP2.4 5.08,49.53 10.16,49.53 13.65,46.04 35.88,46.04 MPU.1
USART1_RX  (via drill 0.61)
  Top 0.254: v40.64,37.78 43.5,37.78 44.13,37.15 44.13,36.2 MPU.20 | v30.48,45.09 10.79,45.09 JP1.1
  Bottom 0.254: v40.64,37.78 33.34,45.09 v30.48,45.09
USART1_TX  (via drill 0.61)
  Top 0.254: v45.4,34.61 45.09,34.92 45.09,35.88 MPU.21 | v25.08,39.69 20,39.69 17.78,41.91 7.62,41.91 6.99,42.55 6.99,43.81 JP1.2
  Bottom 0.254: v45.4,34.61 44.13,33.34 31.43,33.34 v25.08,39.69
VBUS  (via drill 0.61)
  Top 0.254: 16.51,37.47 19.05,37.47 C23.1 | 16.51,37.47 15.24,37.47 C22.1 | v19.37,33.02 U1.5 | 16.51,37.47 v16.51,35.88 | 23.18,28.57 24.45,28.57 33.97,38.1 33.97,39.69 35.24,40.96 35.88,40.96 MPU.7 | 23.18,28.57 15.24,28.57 C17.1 | 23.18,28.57 v23.18,29.21
  Bottom 0.254: v16.51,35.88 v19.37,33.02 v23.18,29.21
VCC
  Top 0.254: C9.A 93.98,26.67
  Top 0.813: V_BATT_6V.1 86.36,12.7 77.47,12.7 LM1117I_3.3V.3 C10.A
  Top 1.016: LM1117I_5V.3 87.63,30.48 93.98,30.48 93.98,26.67 V_BATT_6V.1

### Text on the board
tNames: HX-1 | E2 | D5 | Belloon HAB v1.0 | C7 | 5V | Jake Glass 2016 | B7 | 3V3 | E6 | F0 | GND | F1 | USART1_TX | USART1_RX | F4 | 5V | HUMIDITY | 3V3 | BARO | GAS